# Altium schematic sheet Sheet1.SchDoc
size A4
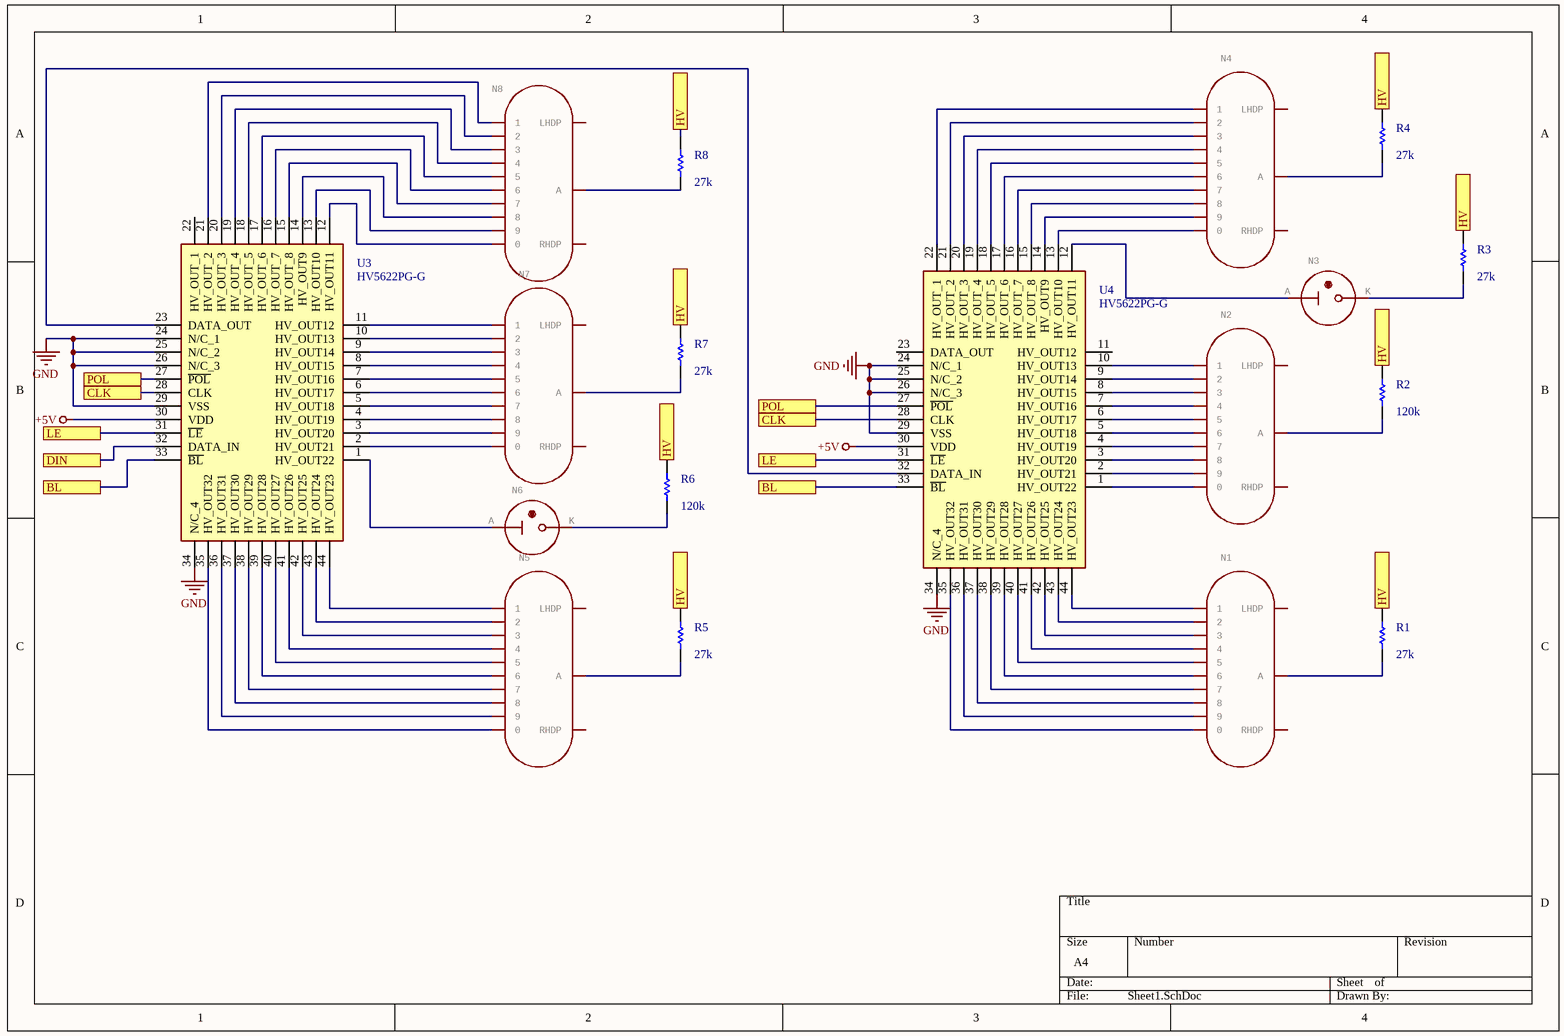
[diagram p0: Sheet1.SchDoc]

## Parts
N1  IN-14: medium numeric frontview nixie tube  [IN-14]  (value not drawn)
N2  IN-14: medium numeric frontview nixie tube  [IN-14]  (value not drawn)
N3  IN-3: nixie bulb  [IN-3]  (value not drawn)
N4  IN-14: medium numeric frontview nixie tube  [IN-14]  (value not drawn)
N5  IN-14: medium numeric frontview nixie tube  [IN-14]  (value not drawn)
N6  IN-3: nixie bulb  [IN-3]  (value not drawn)
N7  IN-14: medium numeric frontview nixie tube  [IN-14]  (value not drawn)
N8  IN-14: medium numeric frontview nixie tube  [IN-14]  (value not drawn)
R1  value 27k  [AXIAL-0.3]
R2  value 120k  [AXIAL-0.3]
R3  value 27k  [AXIAL-0.3]
R4  value 27k  [AXIAL-0.3]
R5  value 27k  [AXIAL-0.3]
R6  value 120k  [AXIAL-0.3]
R7  value 27k  [AXIAL-0.3]
R8  value 27k  [AXIAL-0.3]
U3  HV5622PG-G  [QFP80P1390X1390X235-44N]
U4  HV5622PG-G  [QFP80P1390X1390X235-44N]

## Ports
BL, CLK, DIN, HV, LE, POL

## Nets
+5V: U3.30(VDD) U4.30(VDD)
GND: U3.24(N/C_1) U3.25(N/C_2) U3.26(N/C_3) U3.29(VSS) U3.34(N/C_4) U4.24(N/C_1) U4.25(N/C_2) U4.26(N/C_3) U4.29(VSS) U4.34(N/C_4)
BL: U3.33(~{BL}) U4.33(~{BL}) ; port BL
CLK: U3.28(CLK) U4.28(CLK) ; port CLK
DIN: U3.32(DATA_IN) ; port DIN
HV: R1.1 R2.1 R3.1 R4.1 R5.1 R6.1 R7.1 R8.1 ; port HV
LE: U3.31(~{LE}) U4.31(~{LE}) ; port LE
POL: U3.27(~{POL}) U4.27(~{POL}) ; port POL
NetN1_0: N1.0 U4.35(HV_OUT32)
NetN1_1: N1.1 U4.44(HV_OUT23)
NetN1_2: N1.2 U4.43(HV_OUT24)
NetN1_3: N1.3 U4.42(HV_OUT25)
NetN1_4: N1.4 U4.41(HV_OUT26)
NetN1_5: N1.5 U4.40(HV_OUT27)
NetN1_6: N1.6 U4.39(HV_OUT28)
NetN1_7: N1.7 U4.38(HV_OUT29)
NetN1_8: N1.8 U4.37(HV_OUT30)
NetN1_9: N1.9 U4.36(HV_OUT31)
NetN1_A: N1.A R1.2
NetN2_0: N2.0 U4.1(HV_OUT22)
NetN2_1: N2.1 U4.10(HV_OUT13)
NetN2_2: N2.2 U4.9(HV_OUT14)
NetN2_3: N2.3 U4.8(HV_OUT15)
NetN2_4: N2.4 U4.7(HV_OUT16)
NetN2_5: N2.5 U4.6(HV_OUT17)
NetN2_6: N2.6 U4.5(HV_OUT18)
NetN2_7: N2.7 U4.4(HV_OUT19)
NetN2_8: N2.8 U4.3(HV_OUT20)
NetN2_9: N2.9 U4.2(HV_OUT21)
NetN2_A: N2.A R2.2
NetN3_A: N3.A U4.12(HV_OUT11)
NetN3_K: N3.K R3.2
NetN4_0: N4.0 U4.13(HV_OUT10)
NetN4_1: N4.1 U4.22(HV_OUT_1)
NetN4_2: N4.2 U4.21(HV_OUT_2)
NetN4_3: N4.3 U4.20(HV_OUT_3)
NetN4_4: N4.4 U4.19(HV_OUT_4)
NetN4_5: N4.5 U4.18(HV_OUT_5)
NetN4_6: N4.6 U4.17(HV_OUT_6)
NetN4_7: N4.7 U4.16(HV_OUT_7)
NetN4_8: N4.8 U4.15(HV_OUT_8)
NetN4_9: N4.9 U4.14(HV_OUT9)
NetN4_A: N4.A R4.2
NetN5_0: N5.0 U3.35(HV_OUT32)
NetN5_1: N5.1 U3.44(HV_OUT23)
NetN5_2: N5.2 U3.43(HV_OUT24)
NetN5_3: N5.3 U3.42(HV_OUT25)
NetN5_4: N5.4 U3.41(HV_OUT26)
NetN5_5: N5.5 U3.40(HV_OUT27)
NetN5_6: N5.6 U3.39(HV_OUT28)
NetN5_7: N5.7 U3.38(HV_OUT29)
NetN5_8: N5.8 U3.37(HV_OUT30)
NetN5_9: N5.9 U3.36(HV_OUT31)
NetN5_A: N5.A R5.2
NetN6_A: N6.A U3.1(HV_OUT22)
NetN6_K: N6.K R6.2
NetN7_0: N7.0 U3.2(HV_OUT21)
NetN7_1: N7.1 U3.11(HV_OUT12)
NetN7_2: N7.2 U3.10(HV_OUT13)
NetN7_3: N7.3 U3.9(HV_OUT14)
NetN7_4: N7.4 U3.8(HV_OUT15)
NetN7_5: N7.5 U3.7(HV_OUT16)
NetN7_6: N7.6 U3.6(HV_OUT17)
NetN7_7: N7.7 U3.5(HV_OUT18)
NetN7_8: N7.8 U3.4(HV_OUT19)
NetN7_9: N7.9 U3.3(HV_OUT20)
NetN7_A: N7.A R7.2
NetN8_0: N8.0 U3.12(HV_OUT11)
NetN8_1: N8.1 U3.21(HV_OUT_2)
NetN8_2: N8.2 U3.20(HV_OUT_3)
NetN8_3: N8.3 U3.19(HV_OUT_4)
NetN8_4: N8.4 U3.18(HV_OUT_5)
NetN8_5: N8.5 U3.17(HV_OUT_6)
NetN8_6: N8.6 U3.16(HV_OUT_7)
NetN8_7: N8.7 U3.15(HV_OUT_8)
NetN8_8: N8.8 U3.14(HV_OUT9)
NetN8_9: N8.9 U3.13(HV_OUT10)
NetN8_A: N8.A R8.2
NetU3_23: U3.23(DATA_OUT) U4.32(DATA_IN)

Not connected (* = marked no-connect by the designer): N1 LHDP RHDP; N2 LHDP RHDP; N4 LHDP RHDP; N5 LHDP RHDP; N7 LHDP RHDP; N8 LHDP RHDP; U3 22(HV_OUT_1); U4 11(HV_OUT12) 23(DATA_OUT)

## Library data of the parts
N1 N2 N4 N5 N7 N8 = IN-14: GateName_1: G$1; SymbolName_1: IN-14; LibraryName: nixies-us; DeviceSetName: IN-14; Package: IN-14
N3 N6 = IN-3: GateName_1: G$1; SymbolName_1: IN-3; LibraryName: nixies-us; DeviceSetName: IN-3; Package: IN-3
R1-R8 = Res1: Resistor; Published: 8-Jun-2000; LatestRevisionDate: 17-Jul-2002; LatestRevisionNote: Re-released for DXP Platform.; PackageReference: AXIAL-0.3; Publisher: Altium Limited; PackageDescription: Axial Device, Thru-Hole; 2 Leads; 0.3 in Pin Spacing
U3 U4 = HV5622PG-G: Integrated Circuit; Manufacturer_Name: Microchip; Allied_Number: 70453262; Datasheet Link: https://componentsearchengine.com/Datasheets/1/HV5622PG-G.pdf; Height: 2.35mm; Manufacturer_Part_Number: HV5622PG-G; Mouser Part Number: 689-HV5622PG-G; Mouser Price/Stock: https://www.mouser.com/Search/Refine.aspx?Keyword=689-HV5622PG-G; Allied Price/Stock: https://www.alliedelec.com/microchiptechnologyinc-hv5622pg-g/70453262/